# Altium schematic sheet STM32F401R.SchDoc
size A4
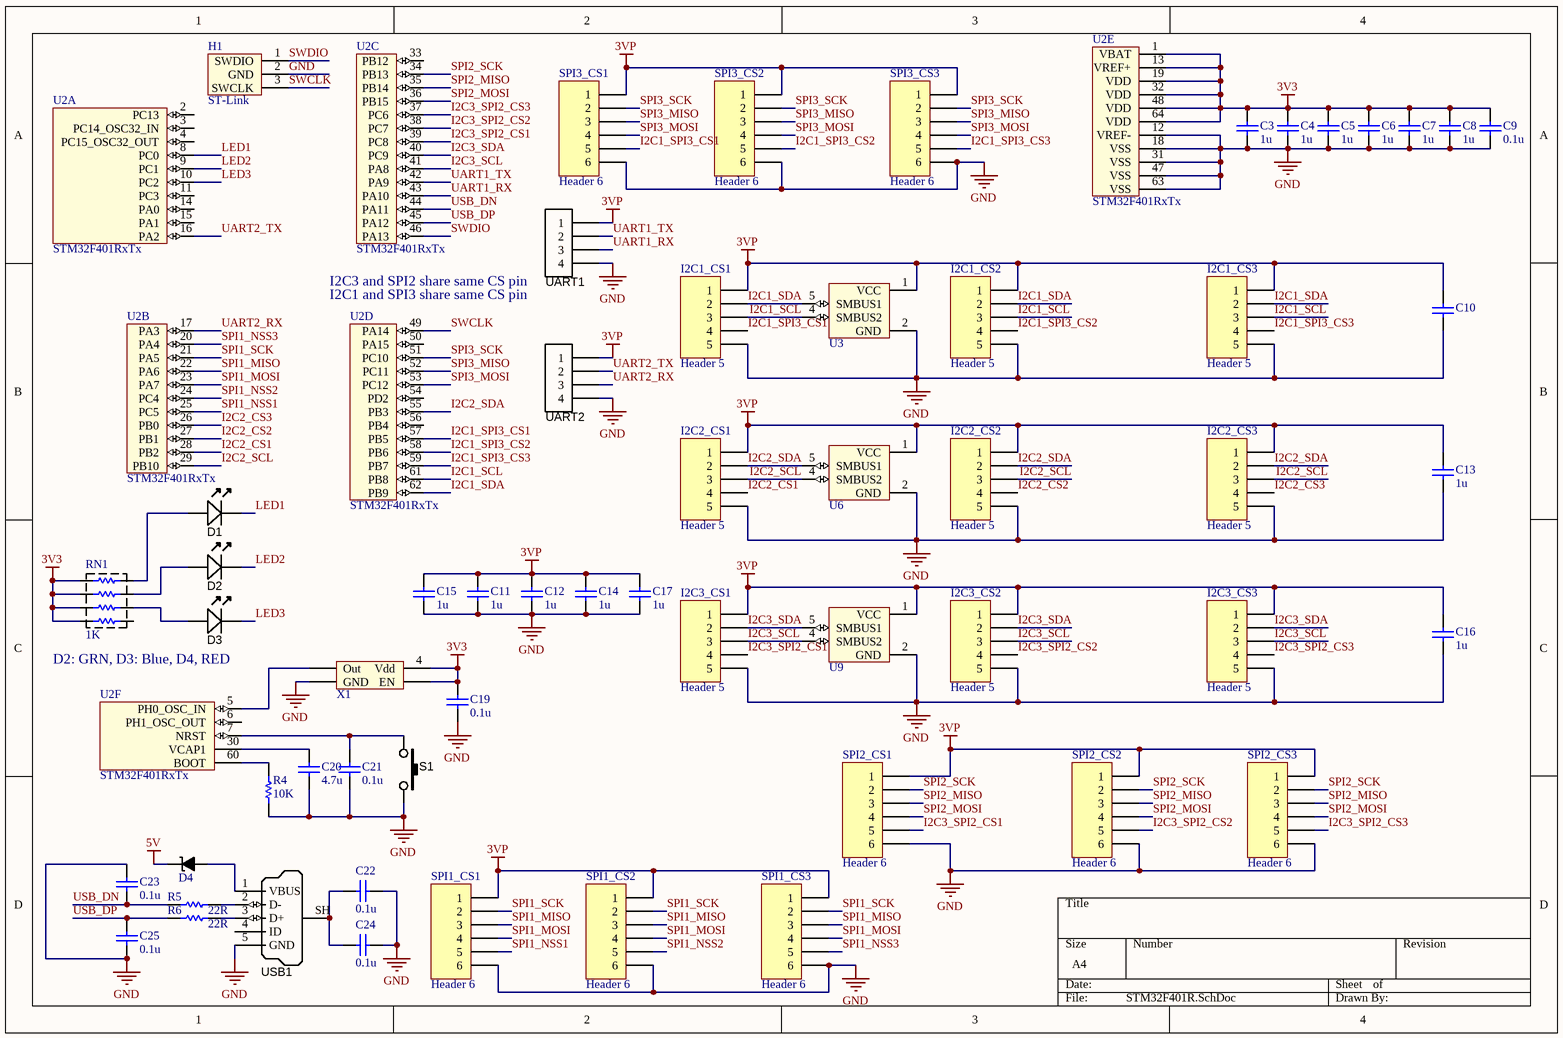
[diagram p0: STM32F401R.SchDoc]

## Parts
C3  value 1u  [CAPC1608X90N]  (hidden comment: Cap)
C4  value 1u  [CAPC1608X90N]  (hidden comment: Cap)
C5  value 1u  [CAPC1608X90N]  (hidden comment: Cap)
C6  value 1u  [CAPC1608X90N]  (hidden comment: Cap)
C7  value 1u  [CAPC1608X90N]  (hidden comment: Cap)
C8  value 1u  [CAPC1608X90N]  (hidden comment: Cap)
C9  value 0.1u  [CAPC1608X90N]  (hidden comment: Cap)
C10  Cap  [CAPC1608X90N]  (value not drawn)
C11  value 1u  [CAPC1608X90N]  (hidden comment: Cap)
C12  value 1u  [CAPC1608X90N]  (hidden comment: Cap)
C13  value 1u  [CAPC1608X90N]  (hidden comment: Cap)
C14  value 1u  [CAPC1608X90N]  (hidden comment: Cap)
C15  value 1u  [CAPC1608X90N]  (hidden comment: Cap)
C16  value 1u  [CAPC1608X90N]  (hidden comment: Cap)
C17  value 1u  [CAPC1608X90N]  (hidden comment: Cap)
C19  value 0.1u  [CAPC1608X90N]  (hidden comment: Cap)
C20  value 4.7u  [CAPC1608X90N]  (hidden comment: Cap)
C21  value 0.1u  [CAPC1608X90N]  (hidden comment: Cap)
C22  value 0.1u  [CAPC1608X90N]  (hidden comment: Cap)
C23  value 0.1u  [CAPC1608X90N]  (hidden comment: Cap)
C24  value 0.1u  [CAPC1608X90N]  (hidden comment: Cap)
C25  value 0.1u  [CAPC1608X90N]  (hidden comment: Cap)
D1  LED_Green_GullWing  [LED-0805-A]  (value not drawn)
D2  LED_Green_GullWing  [LED-0805-A]  (value not drawn)
D3  LED_Green_GullWing  [LED-0805-A]  (value not drawn)
D4  MBRA210LT3G  [SMA]  (value not drawn)
H1  ST-Link  [ST-Link]
I2C1_CS1  Header 5  [HDR1X5]
I2C1_CS2  Header 5  [HDR1X5]
I2C1_CS3  Header 5  [HDR1X5]
I2C2_CS1  Header 5  [HDR1X5]
I2C2_CS2  Header 5  [HDR1X5]
I2C2_CS3  Header 5  [HDR1X5]
I2C3_CS1  Header 5  [HDR1X5]
I2C3_CS2  Header 5  [HDR1X5]
I2C3_CS3  Header 5  [HDR1X5]
R4  value 10K  [RESC1608X55N]  (hidden comment: Res1)
R5  value 22R  [RESC1608X55N]  (hidden comment: Res1)
R6  value 22R  [RESC1608X55N]  (hidden comment: Res1)
RN1  value 1K  [RESCAXS50P160X320X70-8N]  (hidden comment: resistor network)
S1  SW_THT_PB_4.3mm  [TACT_SWT-SMD-4.4]  (value not drawn)
SPI1_CS1  Header 6  [HDR1X6]
SPI1_CS2  Header 6  [HDR1X6]
SPI1_CS3  Header 6  [HDR1X6]
SPI2_CS1  Header 6  [HDR1X6]
SPI2_CS2  Header 6  [HDR1X6]
SPI2_CS3  Header 6  [HDR1X6]
SPI3_CS1  Header 6  [HDR1X6]
SPI3_CS2  Header 6  [HDR1X6]
SPI3_CS3  Header 6  [HDR1X6]
U2  STM32F401RxTx  [LQFP64]  (parts A,B,C,D,E,F of 6)
U3  LTC1694  [SOT23-5]  (value not drawn)
U6  LTC1694  [SOT23-5]  (value not drawn)
U9  LTC1694  [SOT23-5]  (value not drawn)
UART1  Programmer  [HDR1X4_2.54MMP]  (value not drawn)  (no BOM)
UART2  Programmer  [HDR1X4_2.54MMP]  (value not drawn)  (no BOM)
USB1  USB Micro Type B  [USB_MICRO-B]  (value not drawn)
X1  ASV-8.000MHZ-EJ-T  [ASV SERIES]  (value not drawn)

## Nets
3V3: C3.2 C4.2 C5.2 C6.2 C7.2 C8.2 C9.2 C19.2 RN1.1 RN1.2 RN1.3 RN1.4 U2.1(VBAT) U2.13(VREF+) U2.19(VDD) U2.32(VDD) U2.48(VDD) U2.64(VDD) X1.1(EN) X1.4(Vdd)
3VP: C10.2 C11.2 C12.2 C13.2 C14.2 C15.2 C16.2 C17.2 I2C1_CS1.1 I2C1_CS2.1 I2C1_CS3.1 I2C2_CS1.1 I2C2_CS2.1 I2C2_CS3.1 I2C3_CS1.1 I2C3_CS2.1 I2C3_CS3.1 SPI1_CS1.1 SPI1_CS2.1 SPI1_CS3.1 SPI2_CS1.1 SPI2_CS2.1 SPI2_CS3.1 SPI3_CS1.1 SPI3_CS2.1 SPI3_CS3.1 U3.1(VCC) U6.1(VCC) U9.1(VCC) UART1.1 UART2.1
5V: D4.K(Cathode)
GND: C3.1 C4.1 C5.1 C6.1 C7.1 C8.1 C9.1 C10.1 C11.1 C12.1 C13.1 C14.1 C15.1 C16.1 C17.1 C19.1 C20.1 C21.1 C22.2 C23.2 C24.2 C25.1 H1.2(GND) I2C1_CS1.5 I2C1_CS2.5 I2C1_CS3.5 I2C2_CS1.5 I2C2_CS2.5 I2C2_CS3.5 I2C3_CS1.5 I2C3_CS2.5 I2C3_CS3.5 R4.1 S1.2 SPI1_CS1.6 SPI1_CS2.6 SPI1_CS3.6 SPI2_CS1.6 SPI2_CS2.6 SPI2_CS3.6 SPI3_CS1.6 SPI3_CS2.6 SPI3_CS3.6 U2.12(VREF-) U2.18(VSS) U2.31(VSS) U2.47(VSS) U2.63(VSS) U3.2(GND) U6.2(GND) U9.2(GND) UART1.4 UART2.4 USB1.5(GND) X1.2(GND)
I2C1_SCL: I2C1_CS1.3 I2C1_CS2.3 I2C1_CS3.3 U2.61(PB8) U3.4(SMBUS2)
I2C1_SDA: I2C1_CS1.2 I2C1_CS2.2 I2C1_CS3.2 U2.62(PB9) U3.5(SMBUS1)
I2C1_SPI3_CS1: I2C1_CS1.4 SPI3_CS1.5 U2.57(PB5)
I2C1_SPI3_CS2: I2C1_CS2.4 SPI3_CS2.5 U2.58(PB6)
I2C1_SPI3_CS3: I2C1_CS3.4 SPI3_CS3.5 U2.59(PB7)
I2C2_CS1: I2C2_CS1.4 U2.28(PB2)
I2C2_CS2: I2C2_CS2.4 U2.27(PB1)
I2C2_CS3: I2C2_CS3.4 U2.26(PB0)
I2C2_SCL: I2C2_CS1.3 I2C2_CS2.3 I2C2_CS3.3 U2.29(PB10) U6.4(SMBUS2)
I2C2_SDA: I2C2_CS1.2 I2C2_CS2.2 I2C2_CS3.2 U2.55(PB3) U6.5(SMBUS1)
I2C3_SCL: I2C3_CS1.3 I2C3_CS2.3 I2C3_CS3.3 U2.41(PA8) U9.4(SMBUS2)
I2C3_SDA: I2C3_CS1.2 I2C3_CS2.2 I2C3_CS3.2 U2.40(PC9) U9.5(SMBUS1)
I2C3_SPI2_CS1: I2C3_CS1.4 SPI2_CS1.5 U2.39(PC8)
I2C3_SPI2_CS2: I2C3_CS2.4 SPI2_CS2.5 U2.38(PC7)
I2C3_SPI2_CS3: I2C3_CS3.4 SPI2_CS3.5 U2.37(PC6)
LED1: D1.K U2.8(PC0)
LED2: D2.K U2.9(PC1)
LED3: D3.K U2.10(PC2)
SPI1_MISO: SPI1_CS1.3 SPI1_CS2.3 SPI1_CS3.3 U2.22(PA6)
SPI1_MOSI: SPI1_CS1.4 SPI1_CS2.4 SPI1_CS3.4 U2.23(PA7)
SPI1_NSS1: SPI1_CS1.5 U2.25(PC5)
SPI1_NSS2: SPI1_CS2.5 U2.24(PC4)
SPI1_NSS3: SPI1_CS3.5 U2.20(PA4)
SPI1_SCK: SPI1_CS1.2 SPI1_CS2.2 SPI1_CS3.2 U2.21(PA5)
SPI2_MISO: SPI2_CS1.3 SPI2_CS2.3 SPI2_CS3.3 U2.35(PB14)
SPI2_MOSI: SPI2_CS1.4 SPI2_CS2.4 SPI2_CS3.4 U2.36(PB15)
SPI2_SCK: SPI2_CS1.2 SPI2_CS2.2 SPI2_CS3.2 U2.34(PB13)
SPI3_MISO: SPI3_CS1.3 SPI3_CS2.3 SPI3_CS3.3 U2.52(PC11)
SPI3_MOSI: SPI3_CS1.4 SPI3_CS2.4 SPI3_CS3.4 U2.53(PC12)
SPI3_SCK: SPI3_CS1.2 SPI3_CS2.2 SPI3_CS3.2 U2.51(PC10)
SWCLK: H1.3(SWCLK) U2.49(PA14)
SWDIO: H1.1(SWDIO) U2.46(PA13)
UART1_RX: U2.43(PA10) UART1.3
UART1_TX: U2.42(PA9) UART1.2
UART2_RX: U2.17(PA3) UART2.3
UART2_TX: U2.16(PA2) UART2.2
USB_DN: C23.1 R5.1 U2.44(PA11)
USB_DP: C25.2 R6.1 U2.45(PA12)
NetC20_2: C20.2 U2.30(VCAP1)
NetC21_2: C21.2 S1.1 U2.7(NRST)
NetC22_1: C22.1 C24.1 USB1.SH(Shell)
NetD1_A: D1.A RN1.8
NetD2_A: D2.A RN1.7
NetD3_A: D3.A RN1.6
NetD4_A: D4.A(Anode) USB1.1(VBUS)
NetR4_2: R4.2 U2.60(BOOT)
NetR5_2: R5.2 USB1.2(D-)
NetR6_2: R6.2 USB1.3(D+)
NetU2_5: U2.5(PH0_OSC_IN) X1.3(Out)

Not connected (* = marked no-connect by the designer): RN1 5; U2 2(PC13) 3(PC14_OSC32_IN) 4(PC15_OSC32_OUT) 6(PH1_OSC_OUT) 11(PC3) 14(PA0) 15(PA1) 33(PB12) 50(PA15) 54(PD2) 56(PB4); USB1 4(ID)

## Notes on the sheet
- I2C1 and SPI3 share same CS pin
- (near UART1) I2C3 and SPI2 share same CS pin
- D2: GRN, D3: Blue, D4, RED

## Library data of the parts
C3-C17 C19-C25 = Cap: Capacitor; Published: 8-Jun-2000; LatestRevisionDate: 17-Jul-2002; LatestRevisionNote: Re-released for DXP Platform.; PackageReference: RAD-0.3; Publisher: Altium Limited; PackageDescription: Radial Cap, Thru-Hole; 2 Leads; 0.3 in Pin Spacing
D1-D3 = LED_Green_GullWing: LED Gull-wing SMD High-intensity Green 450mcd 574nm; Manufacturer 1: Ligitek; Manufacturer Part Number 1: L8UG9033/TR1; Ratings: 450 mcd; 574 nm; Material: AlGaInP; SCDType: source; Package / Case: 4.6mm Gull-Wing; Color: Green
D4 = MBRA210LT3G: Surface Mount  Schottky Power Rectifier; Manufacturer: ON semiconductor; Vf: 350mV; If: 2A; Vrrm: 10V; datasheet: http://www.mouser.com/ds/2/308/MBRA210LT3-D-76406.pdf
H1 = ST-Link: ST-Link header with silkscreen
I2C1_CS1-I2C1_CS3 I2C2_CS1-I2C2_CS3 I2C3_CS1-I2C3_CS3 = Header 5: Header, 5-Pin; LatestRevisionDate: 17-Jul-2002; LatestRevisionNote: Re-released for DXP Platform.; Publisher: Altium Limited
R4-R6 = Res1: Resistor; Published: 8-Jun-2000; LatestRevisionDate: 17-Jul-2002; LatestRevisionNote: Re-released for DXP Platform.; PackageReference: AXIAL-0.3; Publisher: Altium Limited; PackageDescription: Axial Device, Thru-Hole; 2 Leads; 0.3 in Pin Spacing
RN1 = RES_NET
S1 = SW_THT_PB_4.3mm: Switch, tact, 4.3mm stem; Manufacturer 1: Bond-Tact; Manufacturer Part Number 1: TS-1143-WP-300; SCDType: spec; Function: Speed; Package / Case: 6.5x6.5mm; 4.3mm stem; Material: Brass/Nylon/Ag plating
SPI1_CS1-SPI1_CS3 SPI2_CS1-SPI2_CS3 SPI3_CS1-SPI3_CS3 = Header 6: Header, 6-Pin; LatestRevisionDate: 17-Jul-2002; LatestRevisionNote: Re-released for DXP Platform.; Publisher: Altium Limited
U3 U6 U9 = LTC1694: SMBus/I2C Accelerator                                Improves SMBus/I2CTM Rise Time Transition / Ensures Data Integrity / on the SMBus/I2C / Improves Low State Noise Margin / Parallel Multiple LTC1694-1 Devices / for Increased Drive; VCC(max): 5.5V; VCC(min): 2.7V; Pull up current: 2.2mA; ComponentLink1Description: Datasheet; ComponentLink1URL: https://www.analog.com/media/en/technical-documentation/data-sheets/1694fa.pdf
UART1 UART2 = Header4P: Header 4-pin
USB1 = USB_Micro_TypeB: Connector SMD USB Micro Type B middle mount; Manufacturer 1: Molex Inc; Manufacturer Part Number 1: 47491-0001; SCDType: undef; Package / Case: SMD; Supplier 1: Digi-Key; Supplier Part Number 1: WM17142CT-ND
X1 = ASV-8.000MHZ-EJ-T: 3.3Vdc HCMOS SMD Crystal Clock Oscillator; Manufacturer: Abracon; VDD: 3.3V; Frequency: 8.000MHz